# EAGLE design arduino v2 (EAGLE 9.6.2)
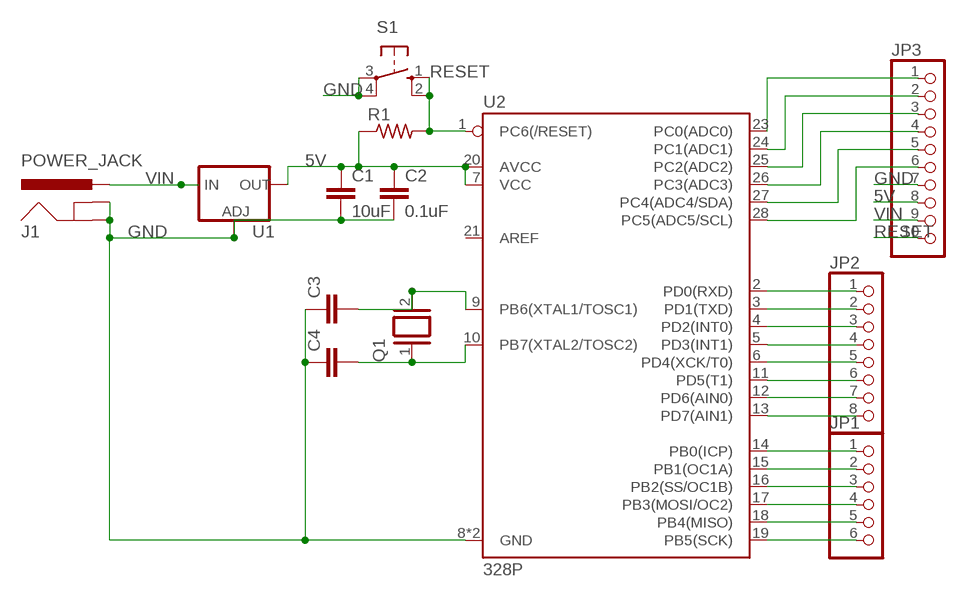
[diagram p0: schematic, sheet 1]

## Parts
C1  10uF  C-EU025-024X044  [C025-024X044]
C2  0.1uF  C-EU025-024X044  [C025-024X044]
C3  C-EU025-024X044  [C025-024X044]
C4  C-EU025-024X044  [C025-024X044]
J1  POWER_JACK  [POWER_JACK_PTH]
JP1  PINHD-1X6  [1X06]
JP2  PINHD-1X8  [1X08]
JP3  PINHD-1X10  [1X10]
Q1  XTAL/S  [QS]
R1  R-US_0204/7  [0204/7]
S1  10-XX  [B3F-10XX]
U1  V_REG_LM1117SOT223  [SOT223]
U2  328P  ATMEGA328P_PDIP  [DIP28]

## Nets
5V: C1.1 C2.1 JP3.8 R1.1 U1.2(OUT) U1.4(OUT) U2.7(VCC) U2.20(AVCC)
GND: C1.2 C2.2 C3.1 C4.1 J1.GND J1.GNDBREAK JP3.7 S1.3(P) S1.4(P1) U1.1(ADJ) U2.8(GND) U2.22(GND)
N$2: JP1.1 U2.14(PB0(ICP))
N$4: C3.2 Q1.2 U2.9(PB6(XTAL1/TOSC1))
N$5: C4.2 Q1.1 U2.10(PB7(XTAL2/TOSC2))
N$6: JP1.2 U2.15(PB1(OC1A))
N$8: JP1.3 U2.16(PB2(SS/OC1B))
N$9: JP1.4 U2.17(PB3(MOSI/OC2))
N$10: JP1.5 U2.18(PB4(MISO))
N$11: JP1.6 U2.19(PB5(SCK))
N$12: JP2.1 U2.2(PD0(RXD))
N$13: JP2.2 U2.3(PD1(TXD))
N$14: JP2.3 U2.4(PD2(INT0))
N$15: JP2.4 U2.5(PD3(INT1))
N$16: JP2.5 U2.6(PD4(XCK/T0))
N$17: JP2.6 U2.11(PD5(T1))
N$18: JP2.7 U2.12(PD6(AIN0))
N$19: JP2.8 U2.13(PD7(AIN1))
N$20: JP3.1 U2.23(PC0(ADC0))
N$21: JP3.2 U2.24(PC1(ADC1))
N$22: JP3.3 U2.25(PC2(ADC2))
N$23: JP3.4 U2.26(PC3(ADC3))
N$24: JP3.5 U2.27(PC4(ADC4/SDA))
N$25: JP3.6 U2.28(PC5(ADC5/SCL))
RESET: JP3.10 R1.2 S1.1(S) S1.2(S1) U2.1(PC6(/RESET))
VIN: J1.PWR JP3.9 U1.3(IN)
Unconnected: U2.21(AREF)

## Library data of the parts
C1-C4 = rcl:C-EU: CAPACITOR, European symbol; SPICEPREFIX: C
J1 = SparkFun-Connectors:POWER_JACK: Power Jack Connector This is the standard 5.5mm barrel jack for power. The PTH is the most common, proven, reliable, footprint. The Slot footprint only works if the mill layer is transmitted to the PCB fab house so be warned. Here are the connectors we sell at SparkFun: DC Barrel Power Jack/Connector <https://www.sparkfun.com/products/119> (PRT-00119) DC Barrel Power Jack/Connector (SMD) <https://www.sparkfun.com/products/12748> (PRT-12748) DC Barrel Jack Adapter - Breadboard Compatible <https://www.sparkfun.com/products/10811> (PRT-10811) It is used on this SparkFun product (and many, many others): SparkFun RedBoard - Programmed with Arduino <https://www.sparkfun.com/products/12757> (DEV-12757) Also, if you need a mating power supply or connector, please check these out: Wall Adapter Power Supply - 9VDC 650mA <https://www.sparkfun.com/products/298> (TOL-00298) DC Barrel Jack Adapter - Male <https://www.sparkfun.com/products/10287> (PRT-10287); PROD_ID: CONN-08197
JP1 = pinhead:PINHD-1X6: PIN HEADER
JP2 = pinhead:PINHD-1X8: PIN HEADER
JP3 = pinhead:PINHD-1X10: PIN HEADER
Q1 = special:XTAL/S: CRYSTAL
R1 = rcl:R-US_: RESISTOR, American symbol; SPICEPREFIX: R
S1 = switch-omron:10-XX: OMRON SWITCH; MPN: B3F-1000; OC_FARNELL: 176432; OC_NEWARK: 36M3542
U1 = SparkFun-IC-Power:V_REG_LM1117: Voltage Regulator LM1117 Standard adjustable voltage regulator but in SMD form. Spark Fun Electronics SKU : COM-00595; PROD_ID: VREG-08170
U2 = SparkFun-IC-Microcontroller:ATMEGA328P_PDIP: Atmel 328P Through hole ATMEGA328P uC used in the Arduino 32kb flash, 1k EEPROM, 2k SRAM Datasheet <http://www.sparkfun.com/datasheets/Components/SMD/ATMega328.pdf> SparkFun Products Storefront component: AVR 28 Pin 20MHz 32K 6A/D - ATMega328P <https://www.sparkfun.com/products/9061> (COM-09061) SparkFun Simon Says - Through-Hole Soldering Kit <https://www.sparkfun.com/products/10547> (KIT-10547) SparkFun Learn to Solder - Simon Says <https://www.sparkfun.com/products/13708> (KIT-13708) SparkFun BigTime Watch Kit <https://www.sparkfun.com/products/11734> (KIT-11734) SparkFun ClockIt <https://www.sparkfun.com/products/10930> (KIT-10930) SparkFun Serial Enabled LCD Kit <https://www.sparkfun.com/products/10097> (LCD-10097) SparkFun Simon Tilts - Through Hole Soldering Kit <https://www.sparkfun.com/products/12634> (KIT-12634) SparkFun Frequency Counter Kit <https://www.sparkfun.com/products/10140> (KIT-10140) FabFM Radio Kit <https://www.sparkfun.com/products/11043> (KIT-11043) SparkFun Binary Blaster Kit <https://www.sparkfun.com/products/12037> (KIT-12037) SparkFun Metro-Gnome <https://www.sparkfun.com/products/9236> (KIT-09236) ATmega328 with Arduino Optiboot (Uno) <https://www.sparkfun.com/products/10524> (DEV-10524); PROD_ID: IC-09136

## Board
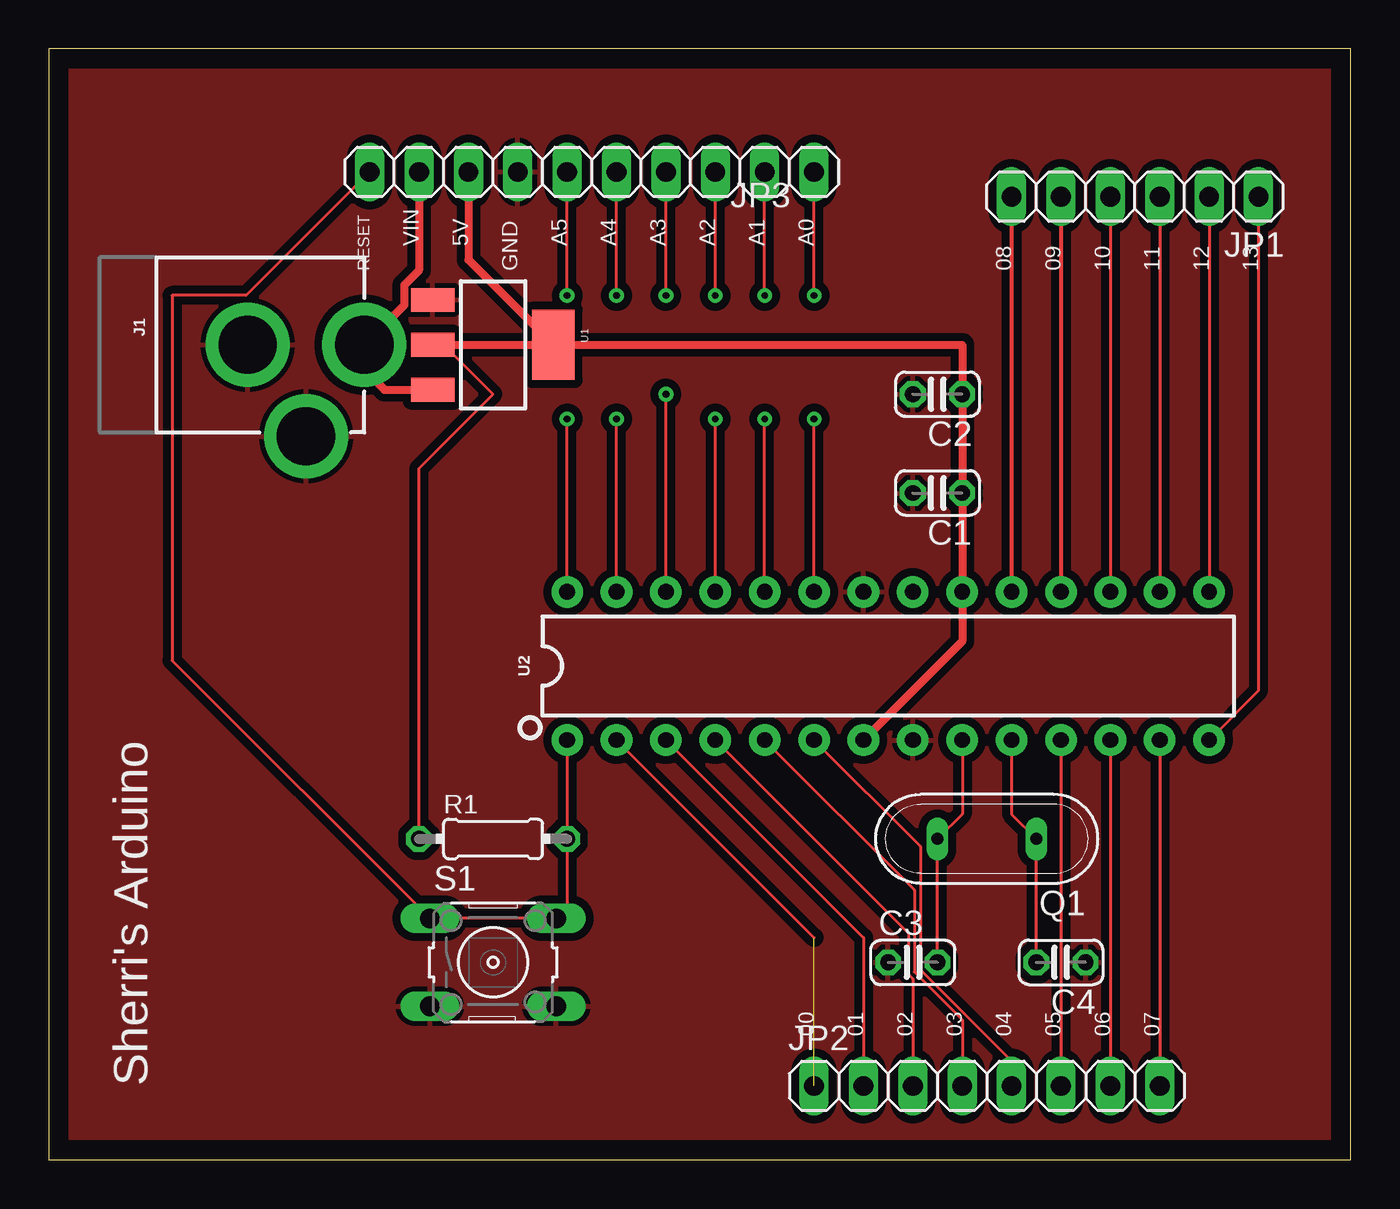
[diagram p1: board, top side]
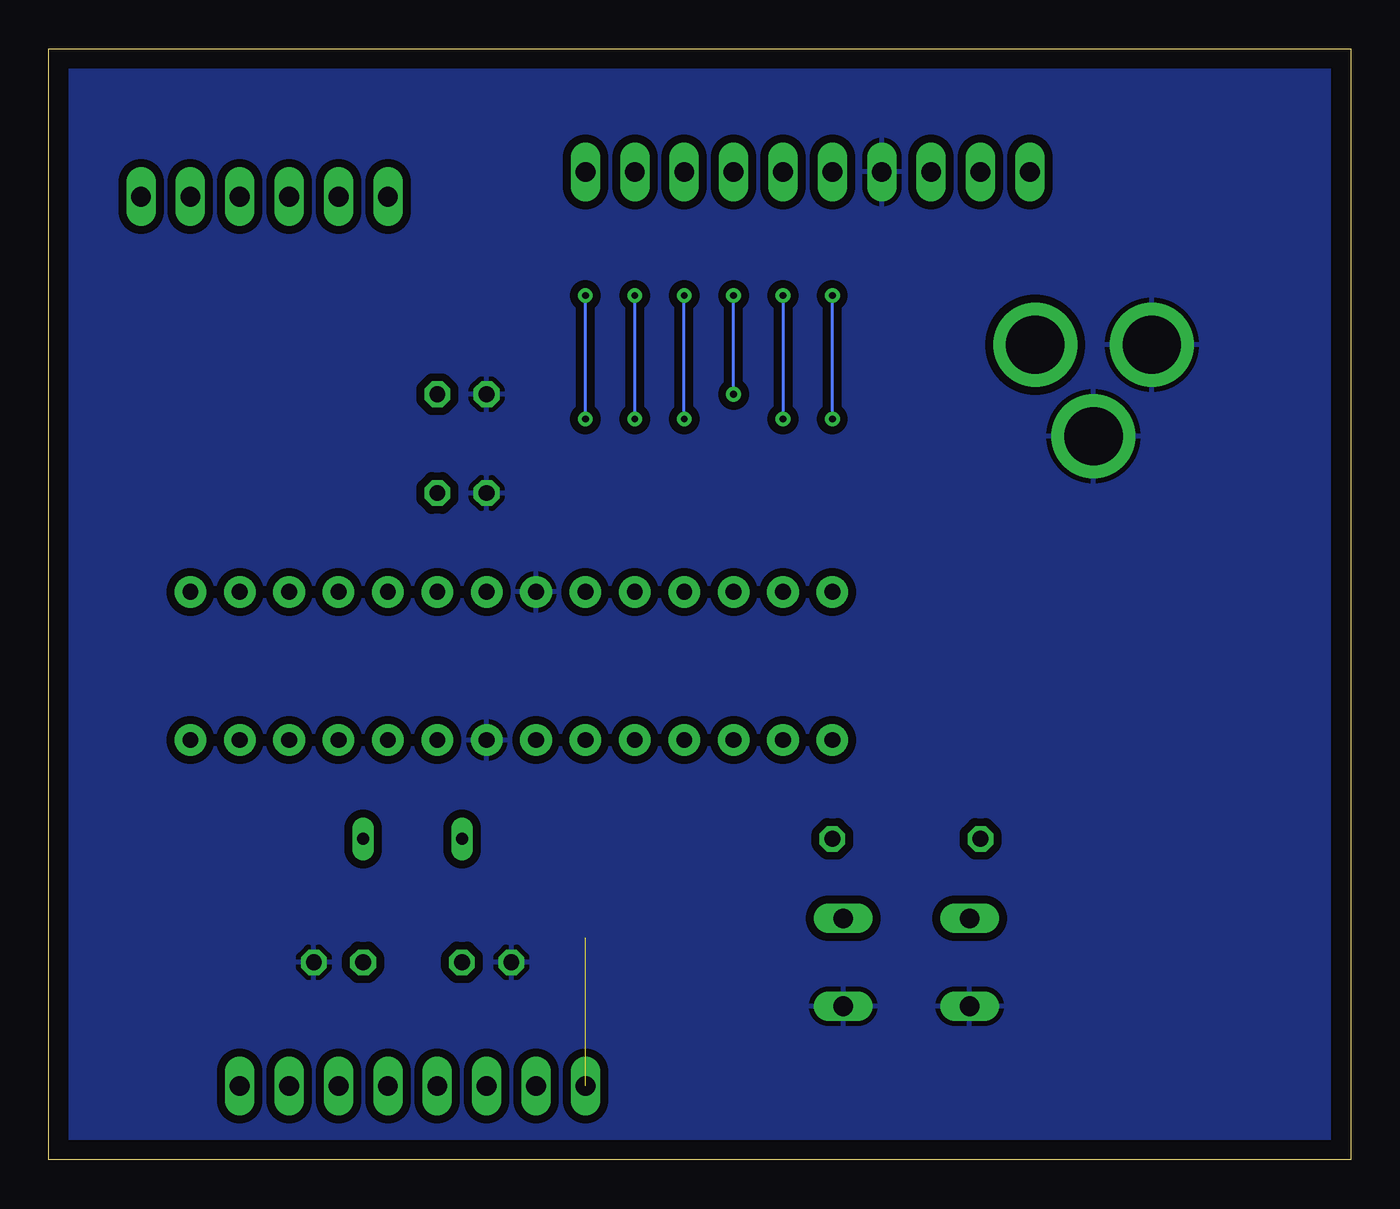
[diagram p2: board, bottom side, seen from below]

Size 66.98 x 57.14 mm. Coordinates in mm from the lower left corner, seen from the top.
Outline: 0,0 66.98,0 66.98,57.14 0,57.14 0,0
Copper layers (1*16): Top 0.035mm / dielectric 1.5mm / Bottom 0.035mm
Design rules "default": minimum track width 6mil, minimum drill 0.35mm, track to track 6mil, track to pad 6mil, pad to pad 6mil, via to via 6mil, smd to smd 6mil, copper to edge 40mil, drill to drill 6mil, minimum pad ring 10mil, minimum via ring 8mil, stop-mask expansion 4mil, vias tented up to drill 0mil, thermal gap 10mil

### Footprints (pad centres in the part's own frame; a part is rotated, then mirrored left to right if it is on the bottom)
C025-024X044 = drill 0.813 octagon: 1 -1.27,0; 2 1.27,0
POWER_JACK_PTH = drill 2.997 pad 4.318: GND 0,7.7; GNDBREAK 4.7,10.7; PWR 0,13.7
1X06 = drill 1.016 long: 1 -6.35,0; 2 -3.81,0; 3 -1.27,0; 4 1.27,0; 5 3.81,0; 6 6.35,0
1X08 = drill 1.016 long: 1 -8.89,0; 2 -6.35,0; 3 -3.81,0; 4 -1.27,0; 5 1.27,0; 6 3.81,0; 7 6.35,0; 8 8.89,0
1X10 = drill 1.016 long: 1 -11.43,0; 2 -8.89,0; 3 -6.35,0; 4 -3.81,0; 5 -1.27,0; 6 1.27,0; 7 3.81,0; 8 6.35,0; 9 8.89,0; 10 11.43,0
QS = drill 0.61 long: 1 -2.54,0; 2 2.54,0
0204/7 = drill 0.813 octagon: 1 -3.81,0; 2 3.81,0
B3F-10XX = drill 1.016 long: 1 -3.251,2.261; 2 3.251,2.261; 3 -3.251,-2.261; 4 3.251,-2.261
SOT223 = smd 1.219 x 2.235: 1 -2.311,-3.099; 2 0,-3.099; 3 2.311,-3.099 | smd 3.6 x 2.2: 4 0,3.099
DIP28 = drill 0.813 pad 1.626: 1 -16.51,-3.81; 2 -13.97,-3.81; 3 -11.43,-3.81; 4 -8.89,-3.81; 5 -6.35,-3.81; 6 -3.81,-3.81; 7 -1.27,-3.81; 8 1.27,-3.81; 9 3.81,-3.81; 10 6.35,-3.81; 11 8.89,-3.81; 12 11.43,-3.81; 13 13.97,-3.81; 14 16.51,-3.81; 15 16.51,3.81; 16 13.97,3.81; 17 11.43,3.81; 18 8.89,3.81; 19 6.35,3.81; 20 3.81,3.81; 21 1.27,3.81; 22 -1.27,3.81; 23 -3.81,3.81; 24 -6.35,3.81; 25 -8.89,3.81; 26 -11.43,3.81; 27 -13.97,3.81; 28 -16.51,3.81

### Placement (x,y rotation side)
C1  45.72,34.29 180 top
C2  45.72,39.37 180 top
C3  44.45,10.16 0 top
C4  52.07,10.16 180 top
J1  2.54,41.91 270 top
JP1  55.88,49.53 180 top
JP2  48.26,3.81 0 top
JP3  27.94,50.8 180 top
Q1  48.26,16.51 180 top
R1  22.86,16.51 0 top
S1  22.86,10.16 0 top
U1  22.86,41.91 270 top
U2  43.18,25.4 0 top

### Tracks (layer width: path | path; a pad name or v marks a point on that pad's centre or on a via)
5V
  Top 0.152: U1.2 20.32,41.91 22.86,39.37 19.05,35.56 R1.1
  Top 0.406: U2.7 46.99,26.67 U2.20 C1.1 C2.1 46.99,41.91 26.67,41.91 U1.4 | JP3.8 21.59,46.28 U1.4 | U1.2 U1.4
GND
  pour Top (isolate 0.406): 0,0 0,57.15 67.31,57.15 67.31,0
  pour Bottom (isolate 0.406): 0,0 0,57.15 67.31,57.15 67.31,0
N$2
  Top 0.152: JP1.1 62.23,24.13 U2.14
N$4
  Top 0.152: U2.9 46.99,17.78 Q1.2 C3.2
N$5
  Top 0.152: U2.10 49.53,17.78 Q1.1 C4.2
N$6
  Top 0.152: JP1.2 U2.15
N$8
  Top 0.152: JP1.3 U2.16
N$9
  Top 0.152: JP1.4 U2.17
N$10
  Top 0.203: JP1.5 U2.18
N$11
  Top 0.203: JP1.6 U2.19
N$12  (1 unrouted)
  Top 0.152: U2.2 39.37,11.43
N$13
  Top 0.152: U2.3 41.91,11.43 JP2.2
N$14
  Top 0.152: U2.4 44.22,11.66 44.22,9.54 44.45,9.31 JP2.3
N$15
  Top 0.152: U2.5 44.53,13.89 44.53,9.67 46.99,7.2 JP2.4
N$16
  Top 0.152: U2.6 44.83,16.13 44.83,9.79 49.53,5.09 JP2.5
N$17
  Top 0.152: U2.11 JP2.6
N$18
  Top 0.152: U2.12 JP2.7
N$19
  Top 0.152: U2.13 JP2.8
N$20  (via drill 0.35)
  Top 0.152: U2.23 v39.37,38.1 | v39.37,44.45 JP3.1
  Bottom 0.152: v39.37,38.1 v39.37,44.45
N$21  (via drill 0.35)
  Top 0.152: U2.24 v36.83,38.1 | v36.83,44.45 JP3.2
  Bottom 0.152: v36.83,38.1 v36.83,44.45
N$22  (via drill 0.35)
  Top 0.152: U2.25 v34.29,38.1 | v34.29,44.45 JP3.3
  Bottom 0.152: v34.29,38.1 v34.29,44.45
N$23  (via drill 0.35)
  Top 0.152: U2.26 v31.75,39.37 | v31.75,44.45 JP3.4
  Bottom 0.152: v31.75,39.37 v31.75,44.45
N$24  (via drill 0.35)
  Top 0.152: U2.27 v29.21,38.1 | v29.21,44.45 JP3.5
  Bottom 0.152: v29.21,44.45 v29.21,38.1
N$25  (via drill 0.35)
  Top 0.152: U2.28 v26.67,38.1 | v26.67,44.45 JP3.6
  Bottom 0.152: v26.67,38.1 v26.67,44.45
RESET
  Top 0.152: U2.1 R1.2 26.67,12.98 S1.2 S1.1 6.35,25.68 6.35,44.45 10.16,44.45 JP3.10
VIN
  Top 0.406: U1.3 17.28,39.6 16.24,40.64 J1.PWR 18.29,43.96 18.29,44.98 19.05,45.74 JP3.9

### Text on the board
tPlace: VIN | 5V | A5 | A4 | A3 | A2 | A1 | A0 | RESET | GND | 08 | 09 | 10 | 11 | 12 | 13 | 00 | 01 | 02 | 03 | 04 | 05 | 06 | 07 | Sherri's Arduino